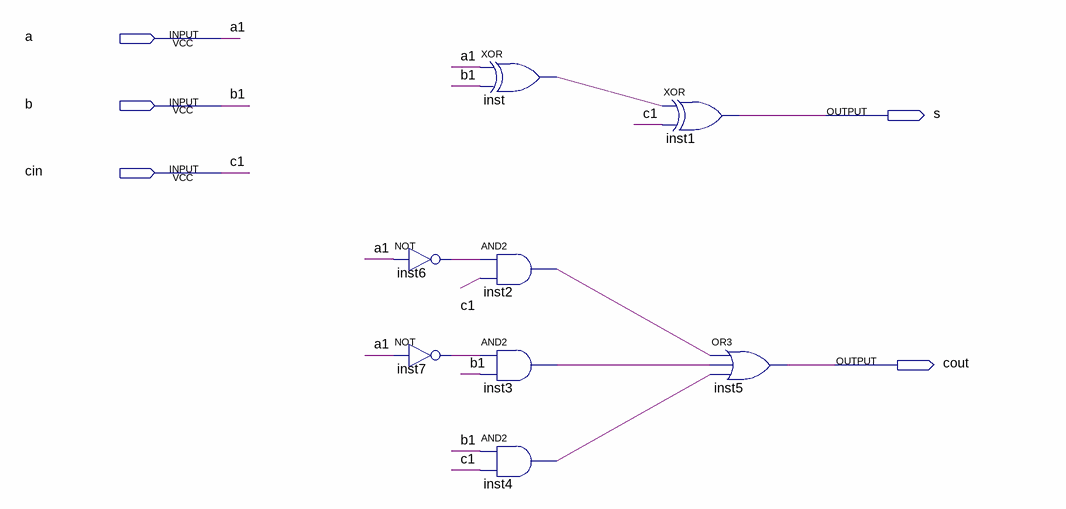
[diagram p0: schematic sheet]
// Quartus schematic aula07.bdf as structural Verilog: 8 symbols, 5 pins
module aula07 (
  input  a,
  input  b,
  input  cin,
  output s,
  output cout
);

  wire inst2_out, inst3_out, inst4_out, inst6_out, inst7_out, inst_out;

  not inst6 (inst6_out, a);
  not inst7 (inst7_out, a);
  xor inst (inst_out, a, b);
  and inst2 (inst2_out, inst6_out, cin);
  and inst3 (inst3_out, inst7_out, b);
  and inst4 (inst4_out, b, cin);
  xor inst1 (s, inst_out, cin);
  or inst5 (cout, inst2_out, inst3_out, inst4_out);

  // Other names for the same wires on the sheet: a1 = a; b1 = b; c1 = cin
endmodule
